# EasyEDA schematic SCH-FlipperZero-FlipperPhone-V0.1.json
TITLE: FlipperZero-FlipperPhone-V0.1; REV: 1.0; Date: 2023-11-18; Sheet: 1/1; Drawn By: Alex-Kaut; Company: AlexKaut
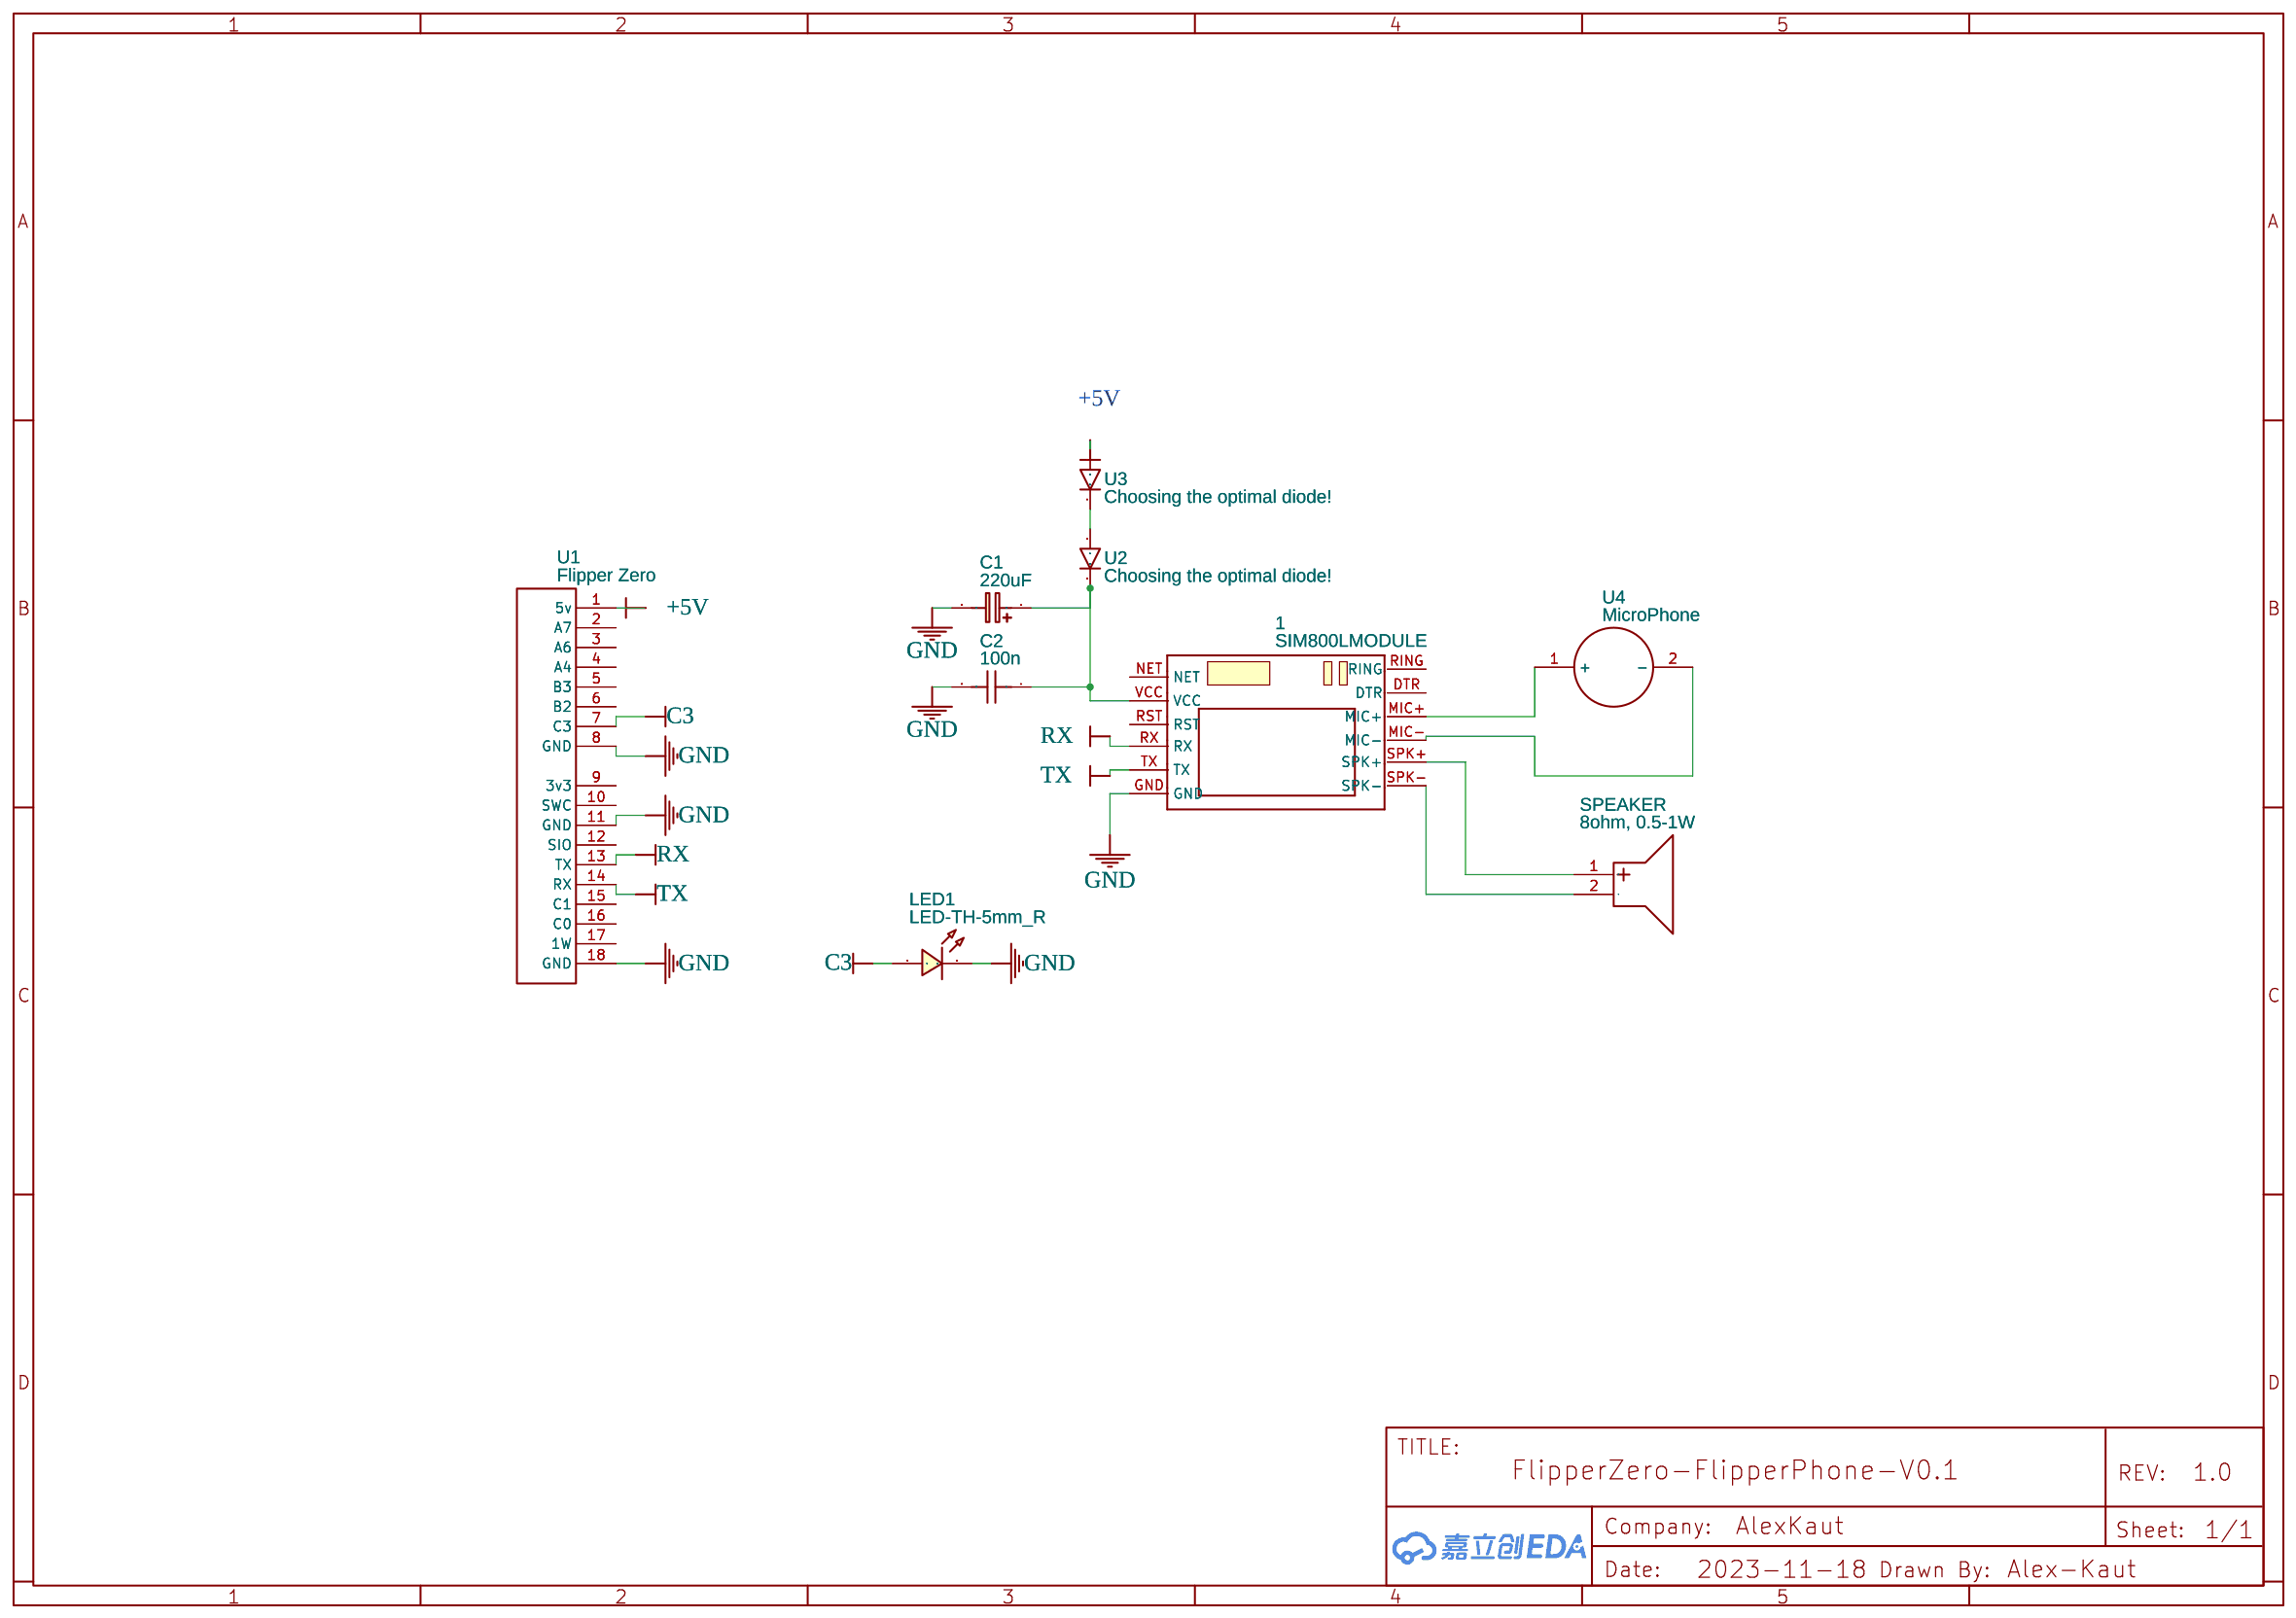
[diagram p0: schematic sheet]

## Parts
1  SIM800LMODULE  [SIM800LMODULE]
C1  220uF  [CAP-D6.3×F2.5]
C2  100n  [RAD-0.2]
LED1  LED-TH-5mm_R  [LED-TH_BD5.0_RED]
SPEAKER  8ohm, 0.5-1W  [SPEAKER-30MM-8OHM-0.5W-TH]
U1  Flipper Zero  [FLIPPER ZERO]
U2  Choosing the optimal diode!  [1N4007]
U3  Choosing the optimal diode!  [1N4007]
U4  MicroPhone  [MICROPHONE]

## Library data of the parts
1 = SIM800LMODULE: Contributor: Salvatore Biancheri
C1 = CE_TH_D6.3×F2.5_EU: Contributor: LCEDA_Lib
C2 = C_RAD-0.2_US: Contributor: LCEDA_Lib
LED1 = LED-TH-5mm_R: Manufacturer: EVERLIGHT(台湾亿光); Manufacturer Part: 333-2SURD/S530-A3; Supplier Part: C87271; Supplier: LCSC; Contributor: LCEDA_Lib
SPEAKER = SPEAKER-30mm-8ohm-0.5w-TH: Supplier: LCSC; Supplier Part: C249440; Manufacturer: Dongguan Bolin Elec; Manufacturer Part: BL-PBZ12065C2705YA; Contributor: LCSC
U1 = Flipper Zero: Contributor: gabrieln2002
U2 U3 = 1N4007A: Contributor: rafael fernandes dos santos
U4 = MicroPhone: Contributor: Van Vu Nguyen

## Nets
+5V: U1.1(5v) U3.1
GND: 1.GND C1.2 C2.2 LED1.2 U1.8(GND) U1.11(GND) U1.18(GND)
C3: LED1.1 U1.7(C3)
RX: 1.RX U1.13(TX)
TX: 1.TX U1.14(RX)
Net-(1-MIC+): 1.MIC+ U4.1(+)
Net-(1-MIC-): 1.MIC- U4.2(-)
Net-(1-SPK+): 1.SPK+ SPEAKER.1(+)
Net-(1-SPK-): 1.SPK- SPEAKER.2(-)
Net-(1-VCC): 1.VCC C1.1 C2.1 U2.2
Net-(U2-1): U2.1 U3.2

Not connected (* = marked no-connect by the designer): 1 DTR NET RING RST; U1 2(A7) 3(A6) 4(A4) 5(B3) 6(B2) 9(3v3) 10(SWC) 12(SIO) 15(C1) 16(C0) 17(1W)
